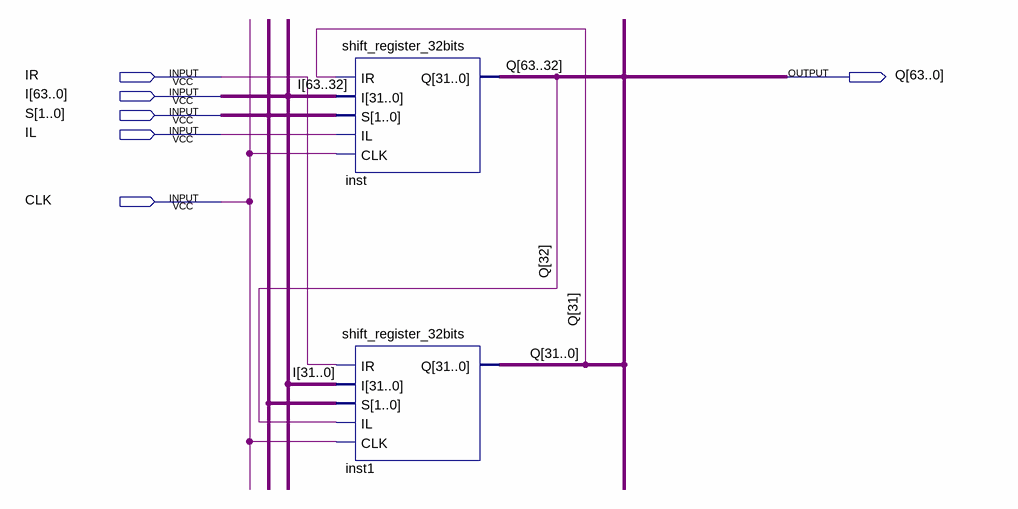
[diagram p0: schematic sheet]
// Quartus schematic shift_register_64bits.bdf as structural Verilog: 2 symbols, 6 pins
module shift_register_64bits (
  input  IR,
  input  [63:0] I,
  input  [1:0] S,
  input  IL,
  input  CLK,
  output [63:0] Q
);

  shift_register_32bits inst (.IR(Q[31]), .I(I[63:32]), .S(S), .IL(IL), .CLK(CLK), .Q(Q[63:32]));
  shift_register_32bits inst1 (.IR(IR), .I(I[31:0]), .S(S), .IL(Q[32]), .CLK(CLK), .Q(Q[31:0]));
endmodule
